# EAGLE design Grove - FM Receiver v1.0 (EAGLE 6.4)
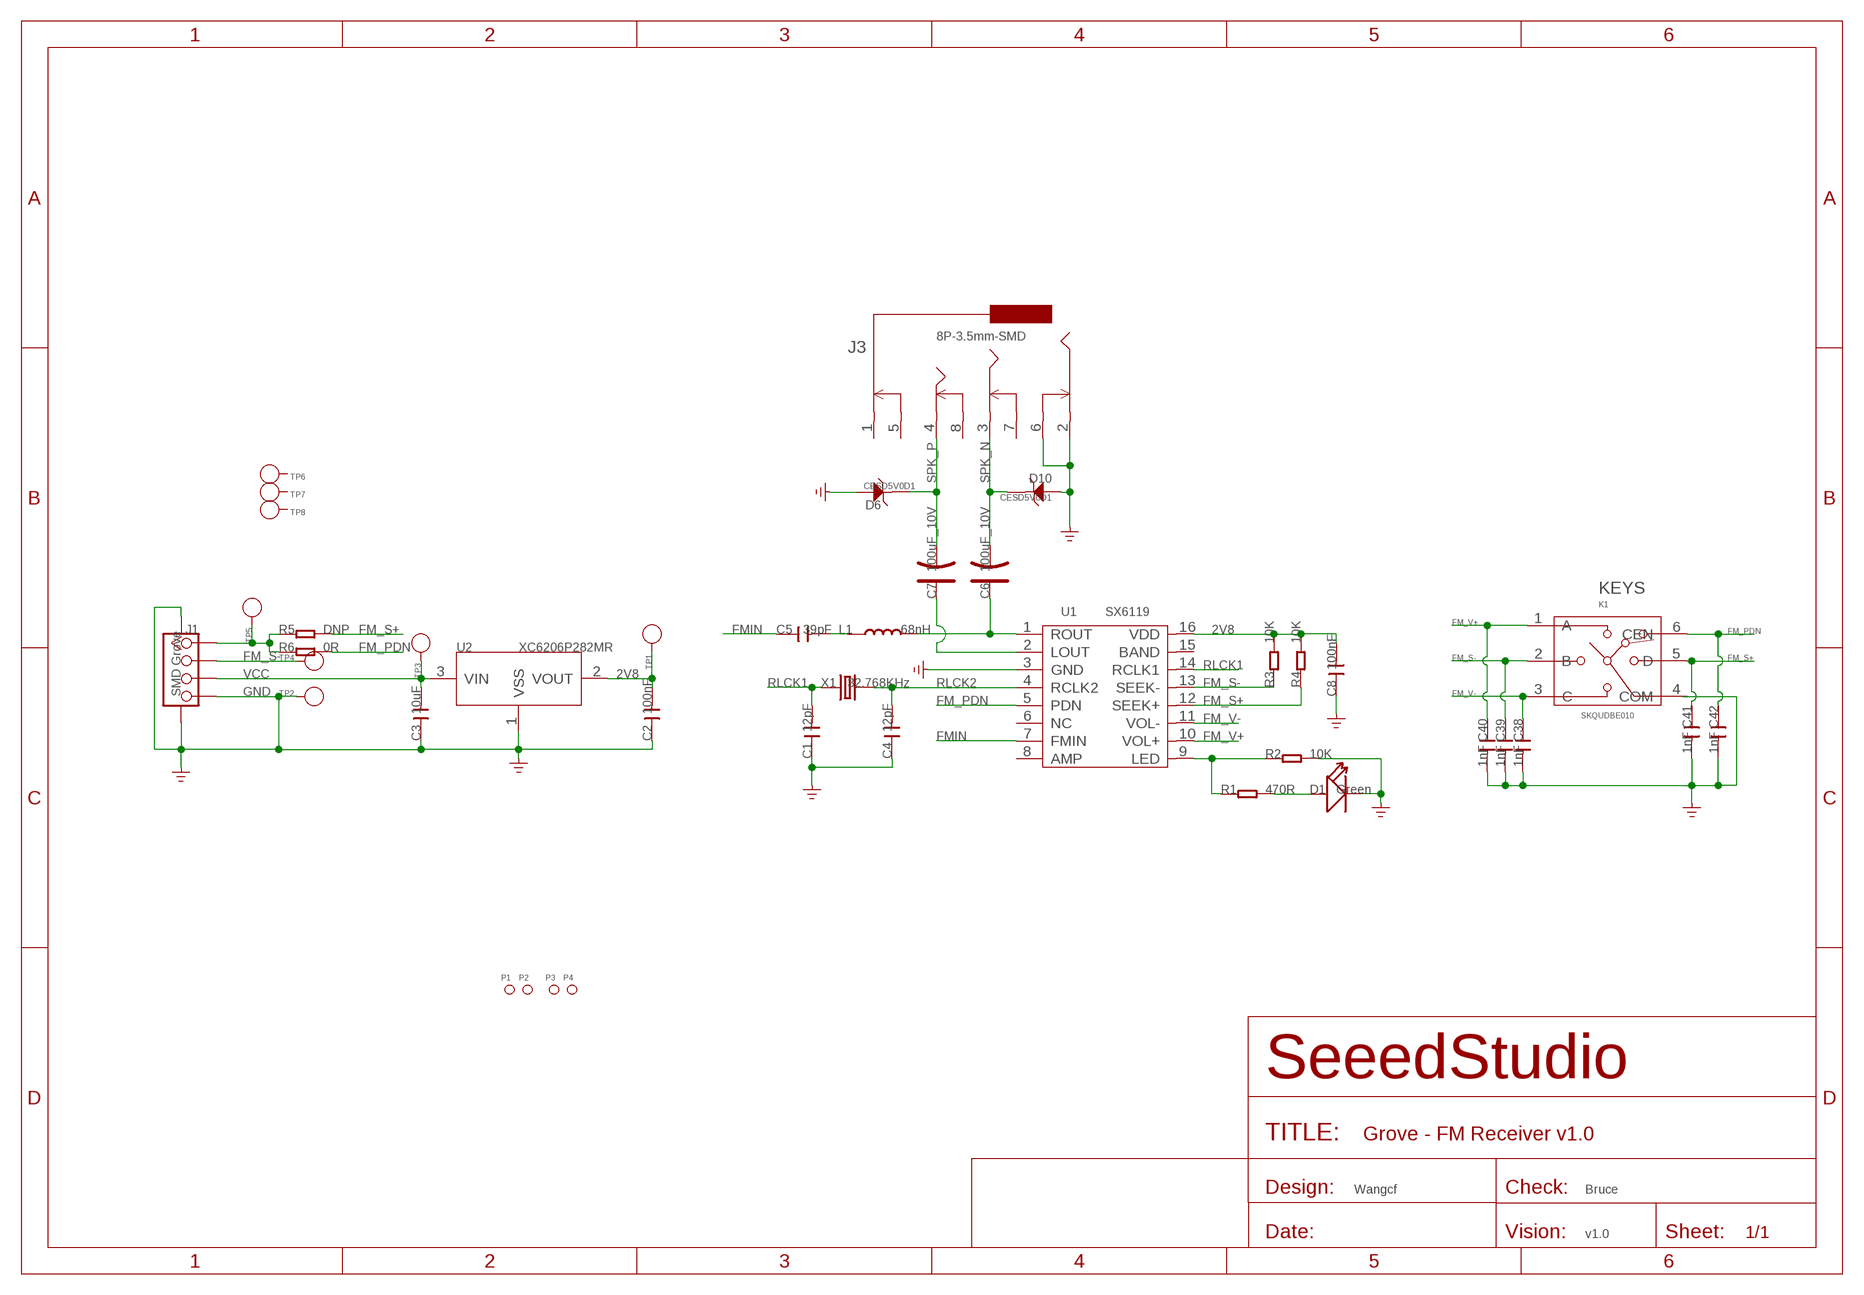
[diagram p0: schematic, sheet 1]

## Parts
C1  12pF  C-0603  [C0603]
C2  100nF  C-0603  [C0603]
C3  10uF  C-0805  [C0805]
C4  12pF  C-0603  [C0603]
C5  39pF  C-0603  [C0603]
C6  100uF_10V  CAP-AVX-B  [AVX-B]
C7  100uF_10V  CAP-AVX-B  [AVX-B]
C8  100nF  C-0603  [C0603]
C38  1nF  C-0603  [C0603]
C39  1nF  C-0603  [C0603]
C40  1nF  C-0603  [C0603]
C41  1nF  C-0603  [C0603]
C42  1nF  C-0603  [C0603]
D1  Green  LED'0603'  [LED-0603]
D6  CESD5V0D1  D-ESD  [SOD123-2.7X1.6]
D10  CESD5V0D1  D-ESD  [SOD123-2.7X1.6]
J1  SMD Grove  TWIG-4P-2.0-SMD-FEMALE-REINFORCE'DD'  [4P-SMD-2.0]
J3  8P-3.5mm-SMD  AUDIO-8P'PJ-3536-L6S'  [8P-3.5-SMD]
K1  SKQUDBE010  [6P-10X10X8.6MM]
L1  68nH  L'0603'  [L0603]
P1  PAD-MARK  [ROUND-MARK-1.0]
P2  PAD-MARK  [ROUND-MARK-1.0]
P3  PAD-MARK  [ROUND-MARK-1.0]
P4  PAD-MARK  [ROUND-MARK-1.0]
R1  470R  R-0603  [R0603]
R2  10K  R-0603  [R0603]
R3  10K  R-0603  [R0603]
R4  10K  R-0603  [R0603]
R5  DNP  R-0603  [R0603]
R6  0R  R-0603  [R0603]
TP1  PAD-TEST-POINT'4545'  [TP_4545]
TP2  PAD-TEST-POINT'4545'  [TP_4545]
TP3  PAD-TEST-POINT'4545'  [TP_4545]
TP4  PAD-TEST-POINT'4545'  [TP_4545]
TP5  PAD-TEST-POINT'4545'  [TP_4545]
TP6  PAD-TEST-POINT'4545'  [TP_4545]
TP7  PAD-TEST-POINT'4545'  [TP_4545]
TP8  PAD-TEST-POINT'4545'  [TP_4545]
U1  SX6119  [SOP16]
U2  XC6206P282MR  XC6206MR  [SOT23]
X1  32.768KHz  CRYSTAL-3215  [2P-SMD-3.2X1.5]

## Nets
2V8: C2.2 C8.2 R3.2 R4.2 TP1.T U1.16(VDD) U2.2(VOUT)
FM_PDN: C42.1 K1.6(CEN) R6.2 U1.5(PDN)
FM_S+: C41.1 K1.5(D) R4.1 R5.2 U1.12(SEEK+)
FM_S-: C39.1 J1.2 K1.2(B) R3.1 TP4.T U1.13(SEEK-)
FM_V+: C40.1 K1.1(A) U1.10(VOL+)
FM_V-: C38.1 K1.3(C) U1.11(VOL-)
FMIN: C5.1 U1.7(FMIN)
GND: C1.1 C2.1 C3.1 C4.1 C8.1 C38.2 C39.2 C40.2 C41.2 C42.2 D1.- D6.1 D10.1 J1.4 J1.SS1 J1.SS2 J3.2 J3.6 K1.4(COM) R2.2 TP2.T U1.3(GND) U2.1(VSS)
N$1: J1.1 R5.1 R6.1 TP5.T
N$2: C5.2 L1.1
N$4: C6.+ L1.2 U1.1(ROUT)
N$5: C7.+ U1.2(LOUT)
N$9: R1.1 R2.1 U1.9(LED)
N$11: D1.+ R1.2
RLCK1: C1.2 U1.14(RCLK1) X1.1
RLCK2: C4.2 U1.4(RCLK2) X1.2
SPK_N: C6.- D10.2 J3.3
SPK_P: C7.- D6.2 J3.4
VCC: C3.2 J1.3 TP3.T U2.3(VIN)
Unconnected: J3.1 J3.5 J3.7 J3.8 TP6.T TP7.T TP8.T U1.6(NC) U1.8(AMP) U1.15(BAND)

## Notes on the sheet
- KEYS
- Wangcf | Bruce
- v1.0

## Library data of the parts
C1-C5 C8 C38-C42 = Discrete:C*: Ceramic Capacitors
C6 C7 = Discrete:CAP*: Electrolytic Capacitors,Tantalum Capacitors and Super Capacitors
D1 = Discrete:LED*
D6 D10 = template:D-ESD: Diodes for Protectiong against ESD
J1 = Connector :TWIG-4P-2.0-SMD-FEMALE-REINFORCE
J3 = template:AUDIO-8P
K1 = template:SKQUDBE010: four dircction and center button
L1 = Discrete:L*
P1-P4 = Discrete:PAD-MARK; PARTNO: DNP
R1-R6 = Discrete:R*
TP1-TP8 = Discrete:PAD-TEST-POINT; PARTNO: DNP
U1 = template:SX6119: FM Moudle
U2 = IC:XC6206: LOW ESR Cap.Compatible Positive Voltage Regulators
X1 = Discrete:CRYSTAL*: CRYSTAL

## Net classes
3 none3: width 0.203 mm, drill 0.305 mm, clearance 0.203 mm

## Board
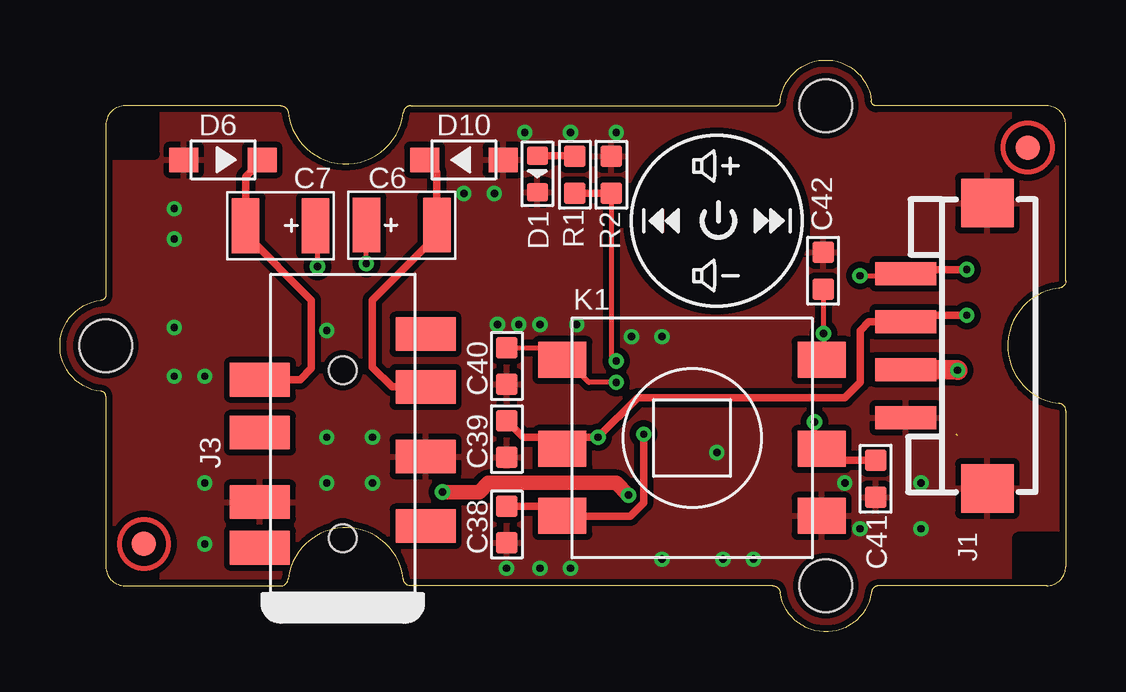
[diagram p1: board, top side]
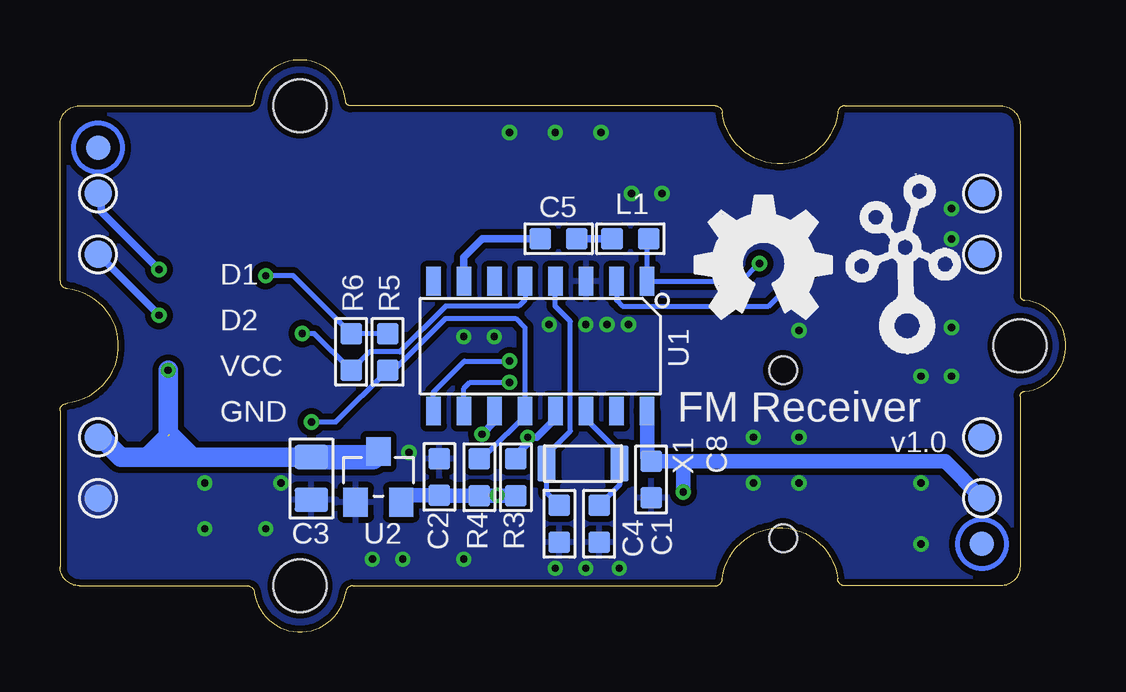
[diagram p2: board, bottom side, seen from below]

Size 41.91 x 23.83 mm. Coordinates in mm from the lower left corner, seen from the top.
Copper layers (1*16): Top 0.035mm / dielectric 1.5mm / Bottom 0.035mm
Design rules "default *": minimum track width 6mil, minimum drill 12mil, track to track 6mil, track to pad 6mil, pad to pad 6mil, via to via 6mil, smd to smd 0mil, copper to edge 10mil, drill to drill 10mil, minimum pad ring 10mil, minimum via ring 6mil, stop-mask expansion 2mil, vias tented up to drill 100mil, thermal gap 10mil

### Footprints (pad centres in the part's own frame; a part is rotated, then mirrored left to right if it is on the bottom)
C0603 = smd 0.889 x 0.889: 1 -0.762,0; 2 0.762,0
C0805 = smd 1.016 x 1.397: 1 -0.889,0; 2 0.889,0
AVX-B = smd 1.143 x 2.286: + -1.46,0; - 1.46,0
LED-0603 = smd 0.762 x 0.889: + -0.762,0; - 0.762,0
SOD123-2.7X1.6 = smd 1.2 x 1.02: 1 -1.635,0; 2 1.635,0
4P-SMD-2.0 = smd 0.965 x 2.54: 1 -3,0; 2 -1,0; 3 1,0; 4 3,0 | smd 2.032 x 2.184: SS1 -5.946,3.4; SS2 5.946,3.4
8P-3.5-SMD = smd 1.4 x 2.5: 1 2.8,-3.45; 2 5.7,-3.45; 3 8.6,-3.45; 4 8.9,3.45; 5 1.9,3.45; 6 3.8,3.45; 7 6.7,3.45; 8 10.8,-3.45 | hole 1.149: 2.3,0; 9.3,0
6P-10X10X8.6MM = smd 2 x 1.5: 1 -5.4,3.25; 2 -5.4,-0.45; 3 -5.4,-3.25; 4 5.4,-3.25; 5 5.4,-0.45; 6 5.4,3.25
L0603 = smd 0.889 x 0.889: 1 -0.762,0; 2 0.762,0
ROUND-MARK-1.0 = smd 1.016 x 1.016: P$1 0,0
R0603 = smd 0.889 x 0.889: 1 -0.762,0; 2 0.762,0
TP_4545 = smd 1.143 x 1.143: T 0,0
SOP16 = smd 0.6 x 1.2: 1 -4.445,-2.7; 2 -3.175,-2.7; 3 -1.905,-2.7; 4 -0.635,-2.7; 5 0.635,-2.7; 6 1.905,-2.7; 7 3.175,-2.7; 8 4.445,-2.7; 9 4.445,2.7; 10 3.175,2.7; 11 1.905,2.7; 12 0.635,2.7; 13 -0.635,2.7; 14 -1.905,2.7; 15 -3.175,2.7; 16 -4.445,2.7
SOT23 = smd 1.016 x 1.2: 1 -0.95,-1.06; 2 0.95,-1.06; 3 0,1.06
GROVE-2CONNECTOR-SMD = hole 2.2: -10,-10; -10,10; 20,0
2P-SMD-3.2X1.5 = smd 0.762 x 1.524: 1 -1.524,0; 2 1.524,0

### Placement (x,y rotation side)
C1  19.45,4.51 90 bottom
C2  26.1,6.46 270 bottom
C3  31.43,6.4 90 bottom
C4  21.1,4.51 90 bottom
C5  21.13,16.38 0 bottom
C6  14.24,16.95 0 top
C7  9.19,16.93 180 top
C8  17.28,6.35 90 bottom
C38  18.62,4.48 270 top
C39  18.62,8.03 270 top
C40  18.62,11.08 270 top
C41  33.99,6.38 270 top
C42  31.8,15.05 90 top
D1  19.89,19.08 270 top
D6  6.8,19.67 0 top
D10  16.83,19.67 180 top
J1  35.24,11.92 270 top
J3  11.78,1.61 90 top
K1  26.34,8.08 0 top
L1  18.15,16.38 0 bottom
P1  3.49,3.67 0 top
P2  40.32,20.18 0 top
P3  3.49,3.67 0 bottom
P4  40.32,20.18 0 bottom
R1  21.45,19.05 90 top
R2  22.97,19.05 90 top
R3  22.91,6.44 270 bottom
R4  24.43,6.44 270 bottom
R5  28.26,11.67 270 bottom
R6  29.78,11.67 270 bottom
TP1  3.49,5.57 180 bottom
TP2  40.32,5.57 180 bottom
TP3  40.32,8.11 180 bottom
TP4  40.32,15.73 180 bottom
TP5  40.32,18.27 180 bottom
TP6  3.49,8.11 180 bottom
TP7  3.49,15.73 180 bottom
TP8  3.49,18.27 180 bottom
U1  21.89,11.91 180 bottom
U2  28.64,6.46 0 bottom
U$7  [OSHW_FILLX200_NOTEXT]  15.43,13.06 0 bottom
U$11  [TWIGLOGO]  6.67,12.56 0 bottom
U$13  [GROVE-2CONNECTOR-SMD]  21.91,11.92 180 top
X1  20.12,7.02 180 bottom

### Tracks (layer width: path | path; a pad name or v marks a point on that pad's centre or on a via)
2V8  (via drill 0.3 pad 0.64)
  Top 0.61: v23.69,5.7 23.18,6.21 17.84,6.21 17.46,5.83 v15.94,5.83
  Bottom 0.61: U2.2 27.39,5.7 C2.2 26.08,5.68 R4.2 R3.2 23.67,5.68 v23.69,5.7 | U1.16 17.45,7.28 C8.2 15.69,7.11 | 15.69,7.11 5.03,7.11 TP1.T | v15.94,5.83 15.94,6.86 15.69,7.11
FM_PDN  (via drill 0.3 pad 0.64)
  Top 0.203: K1.6 31.69,11.28 31.69,11.03 31.81,11.16 v31.81,12.43 31.8,12.44 C42.1
  Bottom 0.203: U1.5 22.53,13.84 22.8,13.57 25.85,13.57 27.75,11.67 29.02,11.67 R6.2 31.31,12.43 v31.81,12.43
FM_S+  (via drill 0.3 pad 0.64)
  Top 0.203: 34.02,7.14 C41.1 33.97,7.16 | v31.43,8.75 31.43,7.93 K1.5
  Top 0.305: C41.1 32.22,7.14 K1.5
  Bottom 0.203: R4.1 24.16,7.48 24.07,7.48 22.53,9.02 U1.12 22.54,9.22 22.54,12.68 22.92,13.06 25.85,13.06 28,10.91 R5.2 30.42,8.75 v31.43,8.75
FM_S-  (via drill 0.3 pad 0.64)
  Top 0.305: 20.64,7.73 20.84,7.73 | 20.84,7.73 K1.2 21.15,7.63 | 20.84,7.73 20.84,7.79 20.51,8.11 19.3,8.11 C39.1 | 21.15,7.63 21.17,7.63 | 21.15,7.63 21.05,7.73 21.02,7.73 21.4,8.11 v22.42,8.11 24.07,9.76 32.7,9.76 33.34,10.4 33.34,12.56 33.7,12.92 J1.2 35.51,13.19 v37.78,13.19
  Bottom 0.203: U1.13 21.26,8.86
  Bottom 0.305: 22.92,7.22 R3.1 22.91,7.36 22.42,7.86 v22.42,8.11 22.04,8.11 21.29,8.86 21.26,8.86 | TP4.T v37.78,13.19
FM_V+  (via drill 0.3 pad 0.64)
  Top 0.203: C40.1 20.42,11.84 K1.1 20.98,11.29 21.15,11.29 22.04,10.4 v23.18,10.4
  Bottom 0.203: U1.10 25.08,9.22 25.08,10.14 24.83,10.4 v23.18,10.4
FM_V-  (via drill 0.3 pad 0.64)
  Top 0.305: C38.1 20.53,5.24 K1.3 20.96,4.81 23.75,4.81 24.32,5.38 v24.32,8.24
  Bottom 0.305: U1.11 23.81,9.22 23.81,8.75 v24.32,8.24
FMIN
  Bottom 0.305: C5.1 24.31,16.38 25.08,15.6 25.08,14.62 U1.7
GND  (via drill 0.3 pad 0.64)
  other vias: 35.88,6.21 32.7,6.21 35.88,4.3 33.34,4.3 28.89,3.03 25.08,3.03 27.62,3.03 27.37,7.48 4.76,12.68 4.76,10.65 6.03,10.65 6.03,6.21 6.03,3.67 11.11,6.21 11.11,8.11 11.11,12.56 13.02,8.11 13.02,6.21 20,12.81 18.1,18.27 16.83,18.27 19.11,12.81 18.23,12.81 23.18,20.81 21.27,20.81 19.37,20.81 4.76,16.37 4.76,17.64 23.81,12.3 25.08,12.3 21.53,12.81 18.61,2.65 20,2.65 21.27,2.65
  pour Bottom (isolate 0.254): -0.32,23.99 42.23,23.99 42.23,-0.14 -0.32,-0.14
  pour Top (isolate 0.254): -0.19,23.99 42.36,23.99 42.36,-0.14 -0.19,-0.14
N$1  (via drill 0.3 pad 0.64)
  Top 0.203: v33.34,14.84 35.16,14.84 J1.1
  Top 0.305: v37.78,15.1 35.42,15.1 J1.1
  Bottom 0.203: R5.1 R6.1 | R6.1 29.91,12.43 | R6.1 32.2,14.84 v33.34,14.84
  Bottom 0.305: TP5.T 40.32,18.14 40.2,18.14 40.2,17.51 v37.78,15.1
N$2
  Bottom 0.305: L1.1 C5.2
N$3
  Top 0.203: 26.86,17.51 arc247 28,17.51
N$4  (via drill 0.3 pad 0.64)
  Top 0.203: v12.76,15.35 12.76,16.94 C6.+
  Bottom 0.203: v12.76,15.35 13.51,14.61 U1.1 17.45,16.32 L1.2
N$5  (via drill 0.3 pad 0.64)
  Top 0.203: v10.73,15.22 10.73,16.85 C7.+
  Bottom 0.203: U1.2 18.72,13.81 18.48,13.57 12.38,13.57 v10.73,15.22
N$6
  Top 0.203: 27.43,17.89 27.43,17.13
N$9  (via drill 0.3 pad 0.64)
  Top 0.203: R2.1 22.97,11.49 v23.18,11.29
  Top 0.305: R1.1 R2.1
  Bottom 0.203: U1.9 26.35,9.22 26.35,9.99 25.06,11.29 v23.18,11.29
N$11
  Top 0.305: D1.+ 21.42,19.84 R1.2
N$17
  pour Top (no thermals): 25.26,17.13 25.76,17.59 25.76,16.67
  pour Top (no thermals): 24.6,17.13 25.11,17.59 25.11,16.67
N$23
  pour Top (no thermals): 29.62,17.59 29.62,16.67 30.13,17.13
N$27
  pour Top (no thermals): 29.62,17.59 30.13,17.13 29.62,16.67
N$28
  pour Top (no thermals): 28.96,17.59 28.96,16.67 29.47,17.13
N$30
  Top 0.152: 26.73,19.16 26.41,19.16 26.41,19.67 26.73,19.67 | 26.73,19.16 26.73,19.67 | 26.73,19.67 27.24,20.05 arc-19 27.24,18.78 26.73,19.16
N$31
  Top 0.152: 27.62,19.41 28.25,19.41
N$32
  Top 0.152: 27.94,19.73 27.94,19.1
N$34
  Top 0.152: 26.73,14.59 26.41,14.59 26.41,15.1 26.73,15.1 | 26.73,14.59 26.73,15.1 | 26.73,15.1 27.24,15.48 arc-19 27.24,14.21 26.73,14.59
N$35
  Top 0.152: 27.62,14.84 28.25,14.84
N$41
  Top 0.152: 24.32,17.59 24.32,16.67
  pour Top (isolate 0.254, no thermals): 25.11,17.59 25.11,16.67 24.6,17.13
N$42
  pour Top (isolate 0.254, no thermals): 25.26,17.13 25.76,17.59 25.76,16.67 25.26,17.13
N$44
  pour Top: 24.6,17.13 25.11,17.59 25.11,16.67 24.6,17.13
N$45
  Top 0.152: 30.42,17.59 30.42,16.67
RLCK1
  Bottom 0.203: U1.14 19.99,8.86 18.73,7.6 18.73,7.16 X1.1 18.59,6.13 C1.2
RLCK2
  Bottom 0.203: U1.4 21.27,14.59 21.27,13.57 20.64,12.94 20.64,8.37 21.64,7.36 X1.2 21.64,5.81 C4.2
SPK_N
  Top 0.305: D10.2 15.7,19.16 C6.- 15.81,16.84 15.81,16.62 13.02,13.83 13.02,11.03 13.85,10.21 J3.3
SPK_P
  Top 0.305: J3.4 10,10.51 10.48,10.98 10.48,13.83 7.73,16.57 C7.- 7.73,18.97 D6.2
VCC  (via drill 0.3 pad 0.64)  (1 unrouted)
  Top 0.813: J1.3 37.39,10.92 v37.4,10.91
  Bottom 0.813: v37.4,10.91 37.4,8.17 38.29,7.29 | TP3.T 40.2,8.11 39.37,7.29 38.29,7.29 | 38.29,7.29 C3.2 | 36.45,7.35 37.34,8.24
  Bottom 1.016: C3.2 28.87,7.29 U2.3
(copper drawn outside any net)
  shapes: Top circle x1

### Text on the board
bPlace: D1 | D2 | VCC | FM Receiver | GND | v1.0